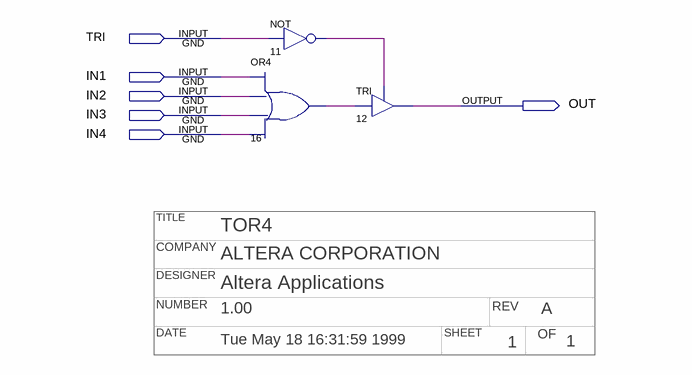
[diagram p0: schematic sheet]
// Quartus schematic tor4.bdf as structural Verilog: 3 symbols, 6 pins
// Title block: TITLE: TOR4; COMPANY: ALTERA CORPORATION; DESIGNER: Altera Applications; NUMBER: 1.00; REV: A; DATE: Tue May 18 16:31:59 1999; SHEET: 1; OF: 1
module tor4 (
  input  TRI,
  input  IN1,
  input  IN2,
  input  IN3,
  input  IN4,
  output OUT
);

  wire n11_out, n16_out;

  not u_11 (n11_out, TRI);
  or u_16 (n16_out, IN1, IN2, IN3, IN4);
  TRI u_12 (.IN(n16_out), .OE(n11_out), .OUT(OUT));
endmodule
